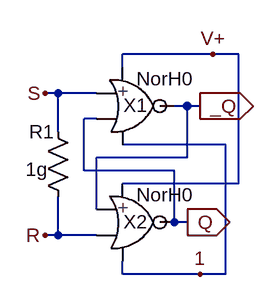
[diagram p0: schematic Ff.asc]
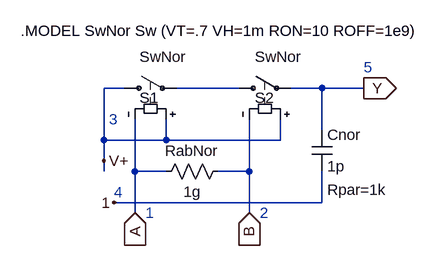
[diagram p1: sub-circuit norh0.asc]
Ff.asc, the LTspice schematic file:
Version 4
SHEET 1 880 680
WIRE -16 240 -32 240
WIRE -16 288 -16 240
WIRE -16 416 -32 416
WIRE -16 416 -16 368
WIRE 16 336 16 272
WIRE 32 240 -16 240
WIRE 32 272 16 272
WIRE 32 384 32 320
WIRE 32 416 -16 416
WIRE 64 208 64 192
WIRE 64 464 64 448
WIRE 128 336 16 336
WIRE 128 400 128 336
WIRE 144 256 128 256
WIRE 144 320 32 320
WIRE 144 320 144 256
WIRE 144 400 128 400
WIRE 160 256 144 256
WIRE 160 464 64 464
WIRE 176 192 64 192
WIRE 192 304 64 304
WIRE 192 464 160 464
WIRE 192 464 192 304
WIRE 208 192 176 192
WIRE 208 352 64 352
WIRE 208 352 208 192
FLAG 160 256 _Q
IOPIN 160 256 Out
FLAG 144 400 Q
IOPIN 144 400 Out
FLAG -32 240 S
FLAG -32 416 R
FLAG 176 192 V+
FLAG 160 464 1
SYMBOL res -32 272 R0
WINDOW 0 -20 16 Left 0
WINDOW 3 -24 62 Left 0
SYMATTR InstName R1
SYMATTR Value 1g
SYMBOL Norh0 80 192 R0
SYMATTR InstName X1
SYMBOL Norh0 80 336 R0
SYMATTR InstName X2

norh0.asc, the sub-circuit schematic file:
Version 4
SHEET 1 880 680
WIRE -48 304 -48 224
WIRE -48 336 -48 304
WIRE -48 352 -48 336
WIRE -16 224 -48 224
WIRE 0 352 0 272
WIRE 0 416 0 352
WIRE 48 304 -48 304
WIRE 48 304 48 272
WIRE 48 352 0 352
WIRE 160 224 64 224
WIRE 176 352 128 352
WIRE 176 352 176 272
WIRE 176 416 176 352
WIRE 224 304 48 304
WIRE 224 304 224 272
WIRE 288 224 240 224
WIRE 288 288 288 224
WIRE 288 400 -32 400
WIRE 288 400 288 352
WIRE 352 224 288 224
FLAG 352 224 Y
IOPIN 352 224 Out
FLAG 0 416 A
IOPIN 0 416 In
FLAG 176 416 B
IOPIN 176 416 In
FLAG -32 400 1
FLAG -48 336 V+
SYMBOL sw -32 224 R270
WINDOW 0 -15 39 VRight 0
WINDOW 3 48 39 VRight 0
SYMATTR InstName S1
SYMATTR Value SwNor
SYMBOL sw 144 224 R270
WINDOW 0 -15 41 VRight 0
WINDOW 3 48 41 VRight 0
SYMATTR InstName S2
SYMATTR Value SwNor
SYMBOL res 144 336 R90
WINDOW 0 0 56 VBottom 0
WINDOW 3 32 56 VTop 0
SYMATTR InstName RabNor
SYMATTR Value 1g
SYMBOL cap 272 288 R0
WINDOW 39 24 92 Left 0
SYMATTR SpiceLine Rpar=1k
SYMATTR InstName Cnor
SYMATTR Value 1p
TEXT 16 416 Left 0 ;1
TEXT 192 416 Left 0 ;2
TEXT 352 192 Left 0 ;5
TEXT -176 136 Left 0 !.MODEL SwNor Sw (VT=.7 VH=1m RON=10 ROFF=1e9)
TEXT -40 272 Left 0 ;3
TEXT -32 384 Left 0 ;4

The netlist it stands for:
* Ff.asc
R1 S R 1g
XX1 S Q V+ 1 _Q norh0 params: NorH0
XX2 _Q R V+ 1 Q norh0 params: NorH0

* block symbol definitions
.subckt norh0 A B V+ 1 Y
S1 V+ N001 V+ A SwNor
S2 N001 Y V+ B SwNor
RabNor B A 1g
Cnor Y 1 1p Rpar=1k
* 1
* 2
* 5
.MODEL SwNor Sw (VT=.7 VH=1m RON=10 ROFF=1e9)
* 3
* 4
.ends norh0

.backanno
.end